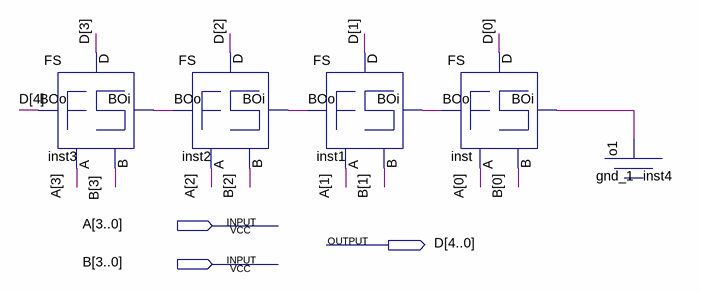
[diagram p0: schematic sheet]
// Quartus schematic FS4.bdf as structural Verilog: 5 symbols, 3 pins
module FS4 (
  input  [3:0] A,
  input  [3:0] B,
  output [4:0] D
);

  wire inst1_boo, inst2_boo, inst4_o1, inst_boo;

  FS inst3 (.BOi(inst2_boo), .A(A[3]), .B(B[3]), .D(D[3]), .BOo(D[4]));
  FS inst2 (.BOi(inst1_boo), .A(A[2]), .B(B[2]), .D(D[2]), .BOo(inst2_boo));
  FS inst1 (.BOi(inst_boo), .A(A[1]), .B(B[1]), .D(D[1]), .BOo(inst1_boo));
  FS inst (.BOi(inst4_o1), .A(A[0]), .B(B[0]), .D(D[0]), .BOo(inst_boo));
  gnd_1 inst4 (.o1(inst4_o1));
endmodule
